# EAGLE design termocouple shield (EAGLE 5.11)
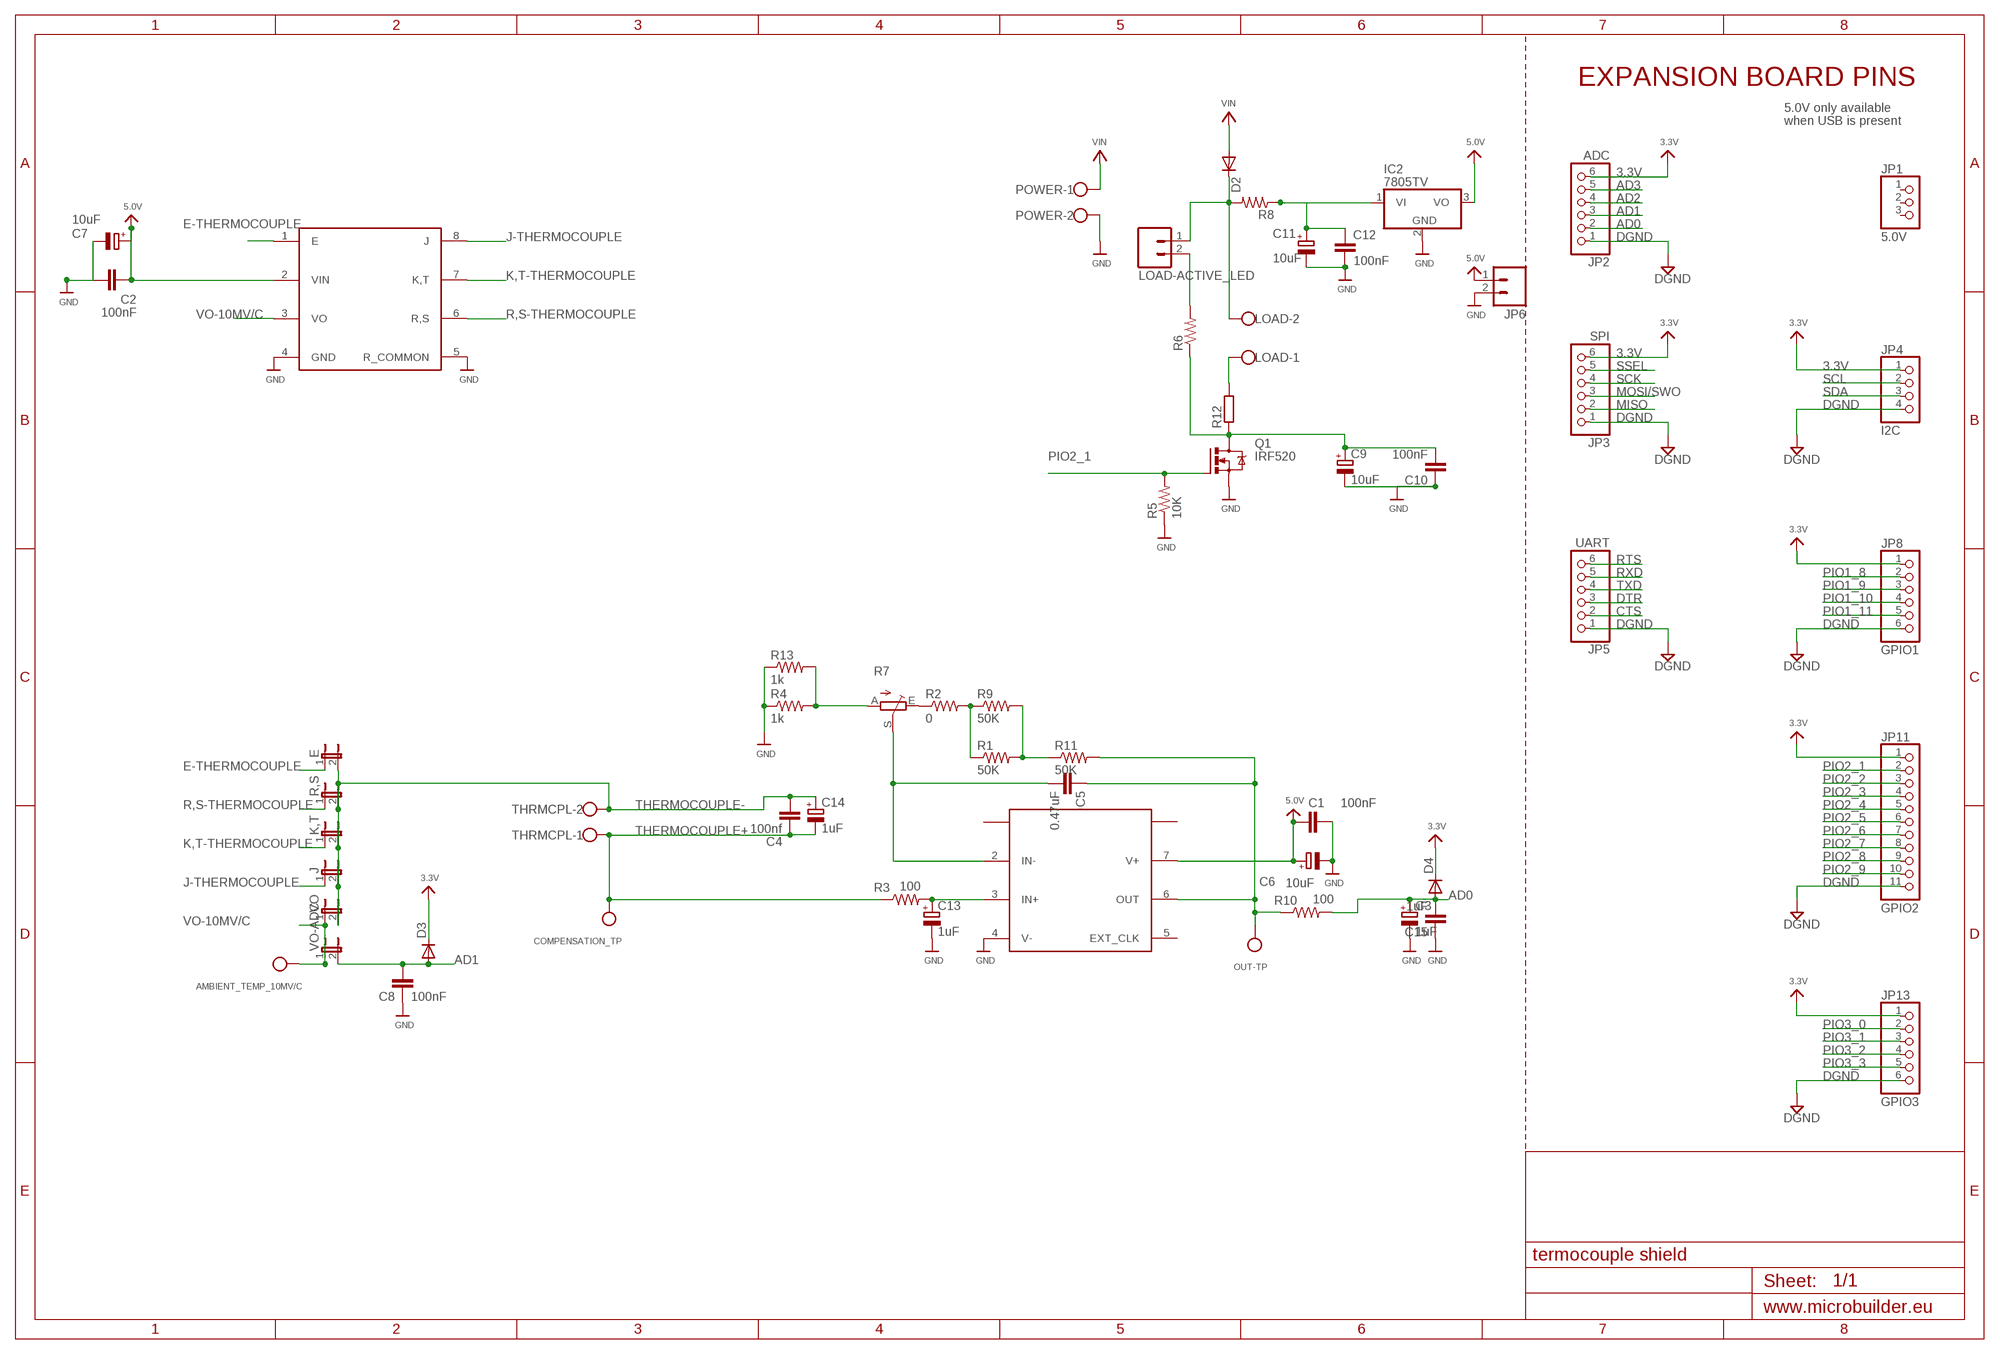
[diagram p0: schematic, sheet 1]

## Parts
AMBIENT_TEMP_10MV/C  TESTPOINT  [TESTPOINT_SMT]
C1  100nF  CAP0805  [0805]
C2  100nF  CAP0805  [0805]
C3  1uF  CPOL-EUB  [PANASONIC_B]
C4  100nf  CAP0805  [0805]
C5  0.47uF  CAP0805  [0805]
C6  10uF  CPOL-EUB  [PANASONIC_B]
C7  10uF  CPOL-EUB  [PANASONIC_B]
C8  100nF  CAP0805  [0805]
C9  10uF  CPOL-EUB  [PANASONIC_B]
C10  100nF  CAP0805  [0805]
C11  10uF  CPOL-EUB  [PANASONIC_B]
C12  100nF  CAP0805  [0805]
C13  1uF  CPOL-EUB  [PANASONIC_B]
C14  1uF  CPOL-EUB  [PANASONIC_B]
C15  1uF  CAP0805  [0805]
COMPENSATION_TP  TESTPOINT  [TESTPOINT_SMT]
D2  DIODEHV  [DIODE-HV]
D3  DIODE-SOD123  [SOD123]
D4  DIODE-SOD123  [SOD123]
E  JUMPER-2-OLDSMD-NO  [SJ_2S-NO]
IC2  7805TV  [TO220V]
J  JUMPER-2-OLDSMD-NO  [SJ_2S-NO]
JP1  5.0V  HEADER-1X3ROUND  [1X03_ROUND]
JP2  ADC  HEADER-1X6ROUND  [1X06_ROUND]
JP3  SPI  HEADER-1X6ROUND  [1X06_ROUND]
JP4  I2C  HEADER-1X4ROUND  [1X04_ROUND]
JP5  UART  HEADER-1X6ROUND  [1X06_ROUND]
JP6  M02LOCK_LONGPADS  [1X02_LOCK_LONGPADS]
JP8  GPIO1  HEADER-1X6ROUND  [1X06_ROUND]
JP11  GPIO2  HEADER-1X11  [1X11_ROUND]
JP13  GPIO3  HEADER-1X6ROUND  [1X06_ROUND]
K,T  JUMPER-2-OLDSMD-NO  [SJ_2S-NO]
LOAD  W237-102  [W237-102]
LOAD-ACTIVE_LED  M02POLAR  [MOLEX-1X2]
OUT-TP  TESTPOINT  [TESTPOINT_SMT]
POWER  W237-102  [W237-102]
Q1  IRF520  [TO220BV]
R1  50K  RESISTOR0805-RES  [0805]
R2  0  RESISTOR0805-RES  [0805]
R3  100  RESISTOR0805-RES  [0805]
R4  1k  RESISTOR0805-RES  [0805]
R5  10K  RESISTOR0805-RES  [0805]
R6  RESISTOR0805-RES  [0805]
R7  TRIM_EU-B64Y  [B64Y]
R8  RESISTOR0805-RES  [0805]
R9  50K  RESISTOR0805-RES  [0805]
R10  100  RESISTOR0805-RES  [0805]
R11  50K  RESISTOR0805-RES  [0805]
R12  R-EU_0617/17  [0617/17]
R13  1k  RESISTOR0805-RES  [0805]
R,S  JUMPER-2-OLDSMD-NO  [SJ_2S-NO]
THRMCPL  W237-102  [W237-102]
U$1  LT1050  [SOP8]
U$2  LT1025  [SOP8]
VO  JUMPER-2-OLDSMD-NO  [SJ_2S-NO]
VO-ADC  JUMPER-2-OLDSMD-NO  [SJ_2S-NO]

## Nets
3.3V: D3.C D4.C JP2.6 JP3.6 JP4.1 JP8.1 JP11.1 JP13.1
5.0V: C1.1 C2.2 C6.+ C7.+ IC2.3(VO) JP6.1 U$1.7(V+) U$2.2(VIN)
AD0: C3.+ C15.2 D4.A JP2.2 R10.2
AD1: C8.2 D3.A JP2.3 VO-ADC.2
AD2: JP2.4
AD3: JP2.5
CTS: JP5.2
DGND: JP2.1 JP3.1 JP4.4 JP5.1 JP8.6 JP11.11 JP13.6
DTR: JP5.3
E-THERMOCOUPLE: E.1 U$2.1(E)
FEEDBACK: C5.1 OUT-TP.P$1 R10.1 R11.2 U$1.6(OUT)
GND: C1.2 C2.1 C3.- C6.- C7.- C8.1 C9.- C10.1 C11.- C12.1 C13.- C15.1 IC2.2(GND) JP6.2 POWER.2 Q1.S R4.1 R5.1 R13.1 U$1.4(V-) U$2.4(GND) U$2.5(R_COMMON)
J-THERMOCOUPLE: J.1 U$2.8(J)
K,T-THERMOCOUPLE: K,T.1 U$2.7(K,T)
MISO: JP3.2
MOSI/SWO: JP3.3
N$1: C9.+ C10.2 Q1.D R6.1 R12.1
N$2: C13.+ R3.2 U$1.3(IN+)
N$3: LOAD-ACTIVE_LED.2 R6.2
N$4: R1.1 R2.2 R9.1
N$5: C5.2 R7.S U$1.2(IN-)
N$6: D2.C LOAD-ACTIVE_LED.1 LOAD.2 R8.2
N$7: R4.2 R7.A R13.2
N$8: R2.1 R7.E
N$9: C11.+ C12.2 IC2.1(VI) R8.1
N$10: LOAD.1 R12.2
N$12: R1.2 R9.2 R11.1
PIO1_8: JP8.2
PIO1_9: JP8.3
PIO1_10: JP8.4
PIO1_11: JP8.5
PIO2_1: JP11.2 Q1.G R5.2
PIO2_2: JP11.3
PIO2_3: JP11.4
PIO2_4: JP11.5
PIO2_5: JP11.6
PIO2_6: JP11.7
PIO2_7: JP11.8
PIO2_8: JP11.9
PIO2_9: JP11.10
PIO3_0: JP13.2
PIO3_1: JP13.3
PIO3_2: JP13.4
PIO3_3: JP13.5
R,S-THERMOCOUPLE: R,S.1 U$2.6(R,S)
RTS: JP5.6
RXD: JP5.5
SCK: JP3.4
SCL: JP4.2
SDA: JP4.3
SSEL: JP3.5
THERMOCOUPLE+: C4.1 C14.- COMPENSATION_TP.P$1 R3.1 THRMCPL.1
THERMOCOUPLE-: C4.2 C14.+ E.2 J.2 K,T.2 R,S.2 THRMCPL.2 VO.2
TXD: JP5.4
VIN: D2.A POWER.1
VO-10MV/C: AMBIENT_TEMP_10MV/C.P$1 U$2.3(VO) VO-ADC.1 VO.1
Unconnected: JP1.1 JP1.2 JP1.3 U$1.1 U$1.5(EXT_CLK) U$1.8

## Notes on the sheet
- EXPANSION BOARD PINS
- 5.0V only available
- when USB is present

## Library data of the parts
AMBIENT_TEMP_10MV/C COMPENSATION_TP OUT-TP = microbuilder:TESTPOINT: Test Point TESTPOINT_SMT - Compact Surface Mount Test Point [Digikey: 5016KTR-ND] TESTPOINT_PAD - Square Pad (2mm) TESTPOINT_SMT - Round Pad (2mm) TESTPOINT_0.1" - 0.1" Header
C1 C2 C4 C5 C8 C10 C12 C15 = SparkFun:CAP: Capacitor Standard 0603 ceramic capacitor, and 0.1" leaded capacitor.
C3 C6 C7 C9 C11 C13 C14 = resistor:CPOL-EU: POLARIZED CAPACITOR, European symbol
D2 = SparkFun:DIODE: Diode These are standard reverse protection diodes and small signal diodes. SMA package can handle up to about 1A. SOD-323 can handle about 200mA. What the SOD-323 package when ordering, there are some mfgs out there that are 5-pin packages.
D3 D4 = diode:DIODE-: DIODE
E J K,T R,S VO VO-ADC = SparkFun:JUMPER-2-OLD: Jumper Basic 0.1" spaced jumper. Use with breakaway headers.
IC2 = linear:78*: Positive VOLTAGE REGULATOR Source: http://cache.national.com/ds/LM/LM78L05.pdf http://www.fairchildsemi.com/ds/LM/LM7805.pdf
JP1 = microbuilder:HEADER-1X3: PIN HEADER
JP2 JP3 JP5 JP8 JP13 = microbuilder:HEADER-1X6: PIN HEADER
JP4 = microbuilder:HEADER-1X4: PIN HEADER
JP6 LOAD-ACTIVE_LED = SparkFun:M02: Header 2 Standard 2-pin 0.1" header. Use with straight break away headers (SKU : PRT-00116), right angle break away headers (PRT-00553), swiss pins (PRT-00743), machine pins (PRT-00117), and female headers (PRT-00115). Molex polarized connector foot print use with SKU : PRT-08233 with associated crimp pins and housings.
JP11 = microbuilder:HEADER-1X11
LOAD POWER THRMCPL = con-wago-500:W237-102: WAGO SCREW CLAMP; MPN: 237-102; OC_FARNELL: unknown; OC_NEWARK: 70K9898
Q1 = transistor-power:IRF520: HEXFET Power MOSFET
R1-R6 R8-R11 R13 = SparkFun:RESISTOR: Resistor Basic schematic elements and footprints for 0603, 1206, and PTH resistors.
R7 = pot:TRIM_EU-: POTENTIOMETER
R12 = resistor:R-EU_: RESISTOR, European symbol
U$1 = mic-misc:LT1050
U$2 = mic-misc:LT1025

## Board
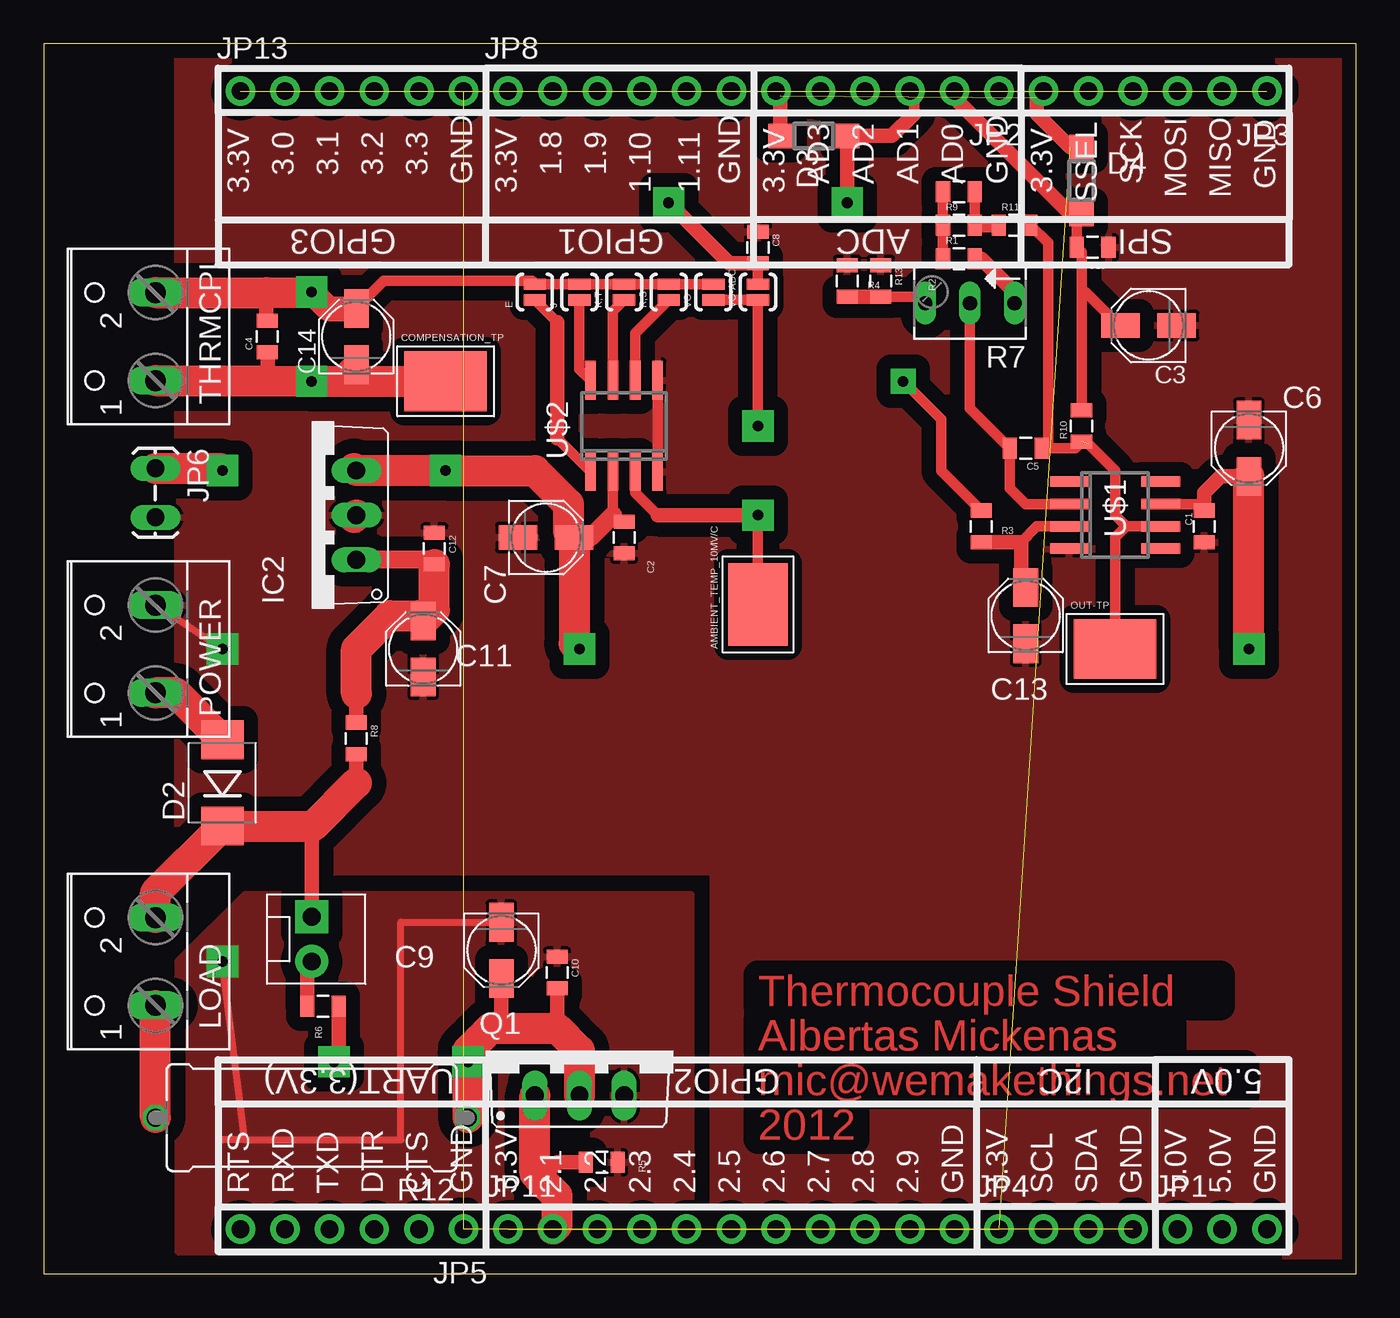
[diagram p1: board, top side]
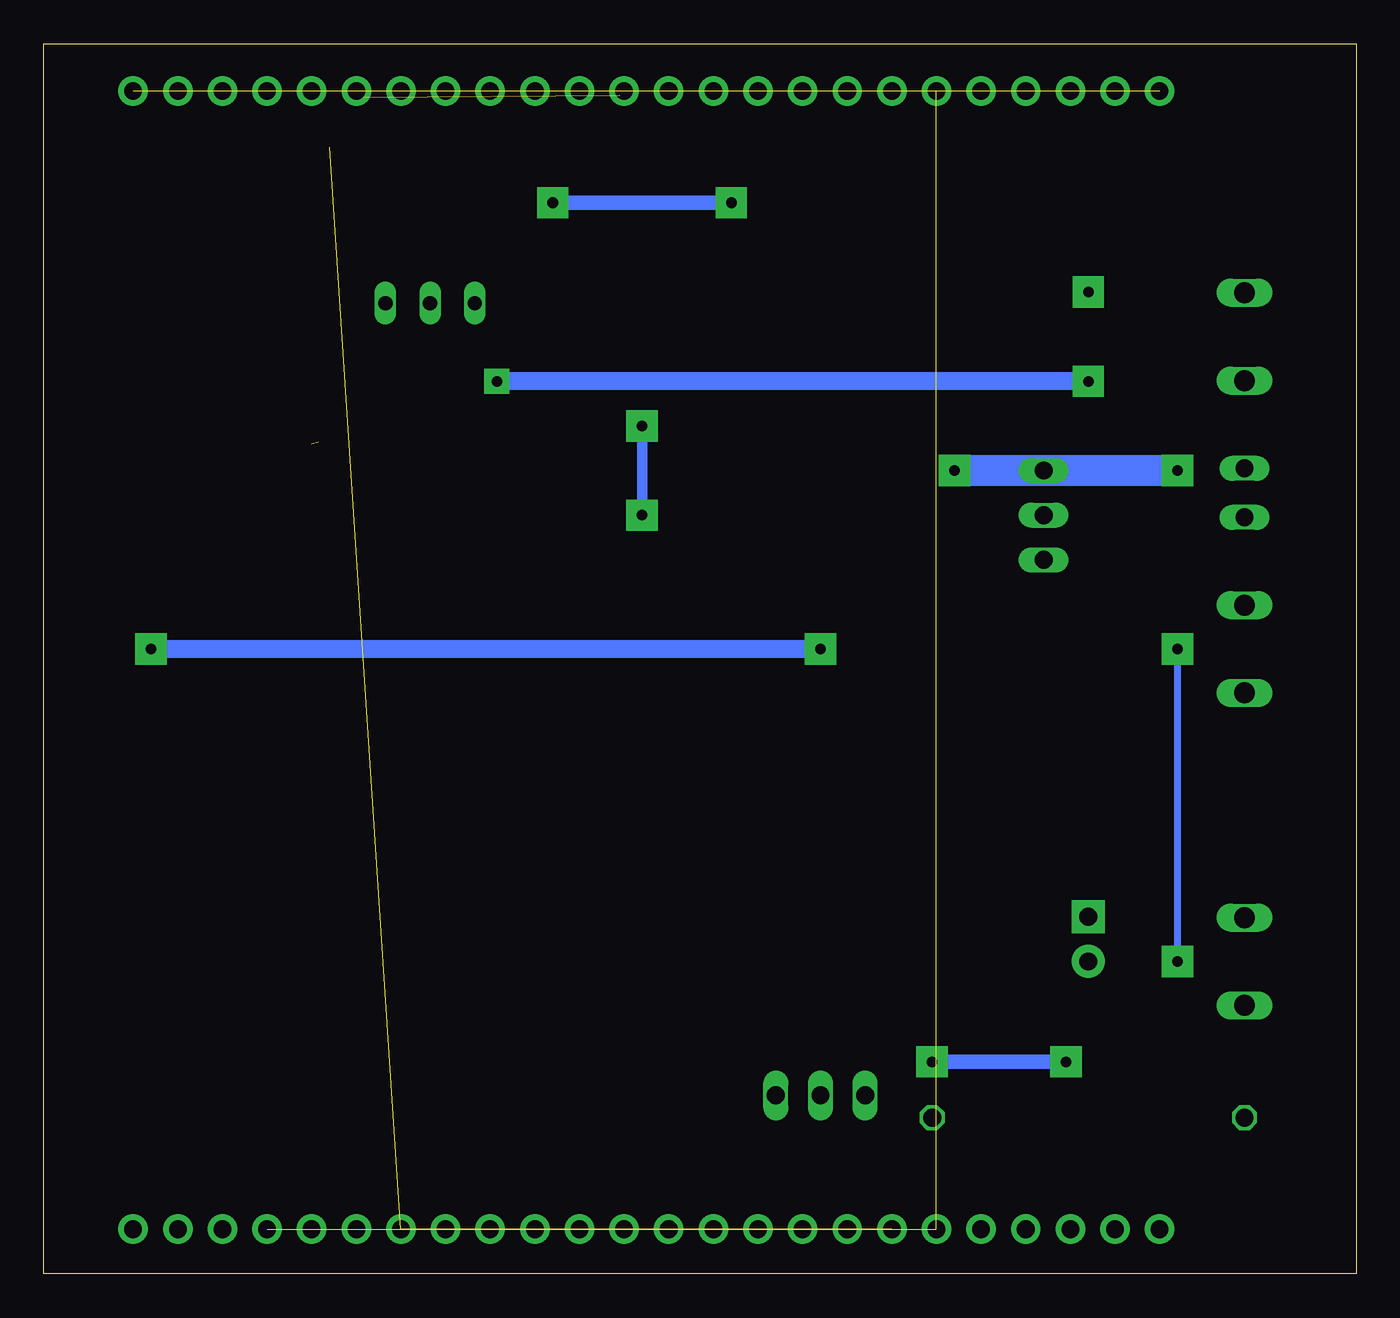
[diagram p2: board, bottom side, seen from below]

Size 74.68 x 70 mm. Coordinates in mm from the lower left corner, seen from the top.
Outline: 74.68,0 74.68,70 0,70 0,0 74.68,0
Copper layers (1*16): Top 0.035mm / dielectric 1.5mm / Bottom 0.035mm
Design rules "PCBCart-.1mmAnnulars": minimum track width 8mil, minimum drill 0.4mm, track to track 8mil, track to pad 8mil, pad to pad 8mil, via to via 8mil, smd to smd 8mil, copper to edge 20mil, drill to drill 8mil, minimum pad ring 8mil, minimum via ring 4mil, stop-mask expansion 3mil, vias tented up to drill 0mil, thermal gap 8mil
tRestrict: area 22.9,2.3 to 23,2.7; area 23.7,3.5 to 24.1,3.5; area 24.8,2.3 to 24.8,2.7; area 51.6,3.5 to 52,3.5; area 52.8,2.3 to 52.8,2.7; area 61,2.3 to 61.1,2.7; area 61.8,3.5 to 62.2,3.5; area 62.9,2.3 to 62.9,2.7; area 68.6,2.3 to 68.7,2.7; area 69.4,3.5 to 69.8,3.5; area 70.5,2.3 to 70.6,2.7; area 69.4,66.4 to 69.8,66.4; 11 more areas

### Footprints (pad centres in the part's own frame; a part is rotated, then mirrored left to right if it is on the bottom)
TESTPOINT_SMT = smd 4.7 x 3.4: P$1 0,0
0805 = smd 0.8 x 1.2: 1 -0.9,0; 2 0.9,0
PANASONIC_B = smd 2.2 x 1.4: + 1.6,0; - -1.6,0
DIODE-HV = smd 2.2 x 2.4: A 2.454,0; C -2.454,0
SOD123 = smd 1.4 x 1.4: A 1.9,0; C -1.9,0
SJ_2S-NO = smd 0.635 x 1.27: 1 -0.45,0; 2 0.45,0
TO220V = drill 1.016 long: 1 -2.54,-2.54; 2 0,-2.54; 3 2.54,-2.54
1X03_ROUND = drill 1 pad 1.676 round: 1 -2.54,0; 2 0,0; 3 2.54,0
1X06_ROUND = drill 1 pad 1.676 round: 1 -6.35,0; 2 -3.81,0; 3 -1.27,0; 4 1.27,0; 5 3.81,0; 6 6.35,0
1X04_ROUND = drill 1 pad 1.676 round: 1 -3.81,0; 2 -1.27,0; 3 1.27,0; 4 3.81,0
1X02_LOCK_LONGPADS = drill 1.016 long: 1 -0.127,0; 2 2.667,0
1X11_ROUND = drill 1 pad 1.676 round: 1 -12.7,0; 2 -10.16,0; 3 -7.62,0; 4 -5.08,0; 5 -2.54,0; 6 0,0; 7 2.54,0; 8 5.08,0; 9 7.62,0; 10 10.16,0; 11 12.7,0
W237-102 = drill 1.194 long: 1 -2.5,-1.27; 2 2.5,-1.27
MOLEX-1X2 = drill 1.016 pad 1.88 square: 1 0,0 | drill 1.016 pad 1.88 round: 2 2.54,0
TO220BV = drill 1.016 long: D 0,-2.54; G -2.54,-2.54; S 2.54,-2.54
B64Y = drill 0.813 long: A 2.54,0; E -2.54,0; S 0,0
0617/17 = drill 1.016 octagon: 1 -8.89,0; 2 8.89,0
SOP8 = smd 0.6 x 2.2: 1 -1.905,-2.6; 2 -0.635,-2.6; 3 0.635,-2.6; 4 1.905,-2.6; 5 1.905,2.6; 6 0.635,2.6; 7 -0.635,2.6; 8 -1.905,2.6

### Placement (x,y rotation side)
AMBIENT_TEMP_10MV/C  40.64,38.1 90 top
C1  66.04,42.55 270 top
C2  33.02,41.91 90 top
C3  62.87,53.98 180 top
C4  12.7,53.34 90 top
C5  55.88,46.99 180 top
C6  68.58,46.99 270 top
C7  28.57,41.91 0 top
C8  40.64,58.42 270 top
C9  26.04,18.41 270 top
C10  29.21,17.14 270 top
C11  21.59,35.56 90 top
C12  22.22,41.27 270 top
C13  55.88,37.47 90 top
C14  17.78,53.34 90 top
C15  59.69,58.42 180 top
COMPENSATION_TP  22.86,50.8 0 top
D2  10.16,27.94 90 top
D3  43.82,64.77 0 top
D4  59.05,62.23 270 top
E  27.94,55.88 90 top
IC2  15.24,43.18 90 top
J  30.48,55.88 90 top
JP1  67.06,2.54 0 top
JP2  48.01,67.31 180 top
JP3  63.25,67.31 180 top
JP4  58.17,2.54 0 top
JP5  17.53,2.54 180 top
JP6  6.35,45.72 270 top
JP8  32.77,67.31 0 top
JP11  39.12,2.54 0 top
JP13  17.53,67.31 0 top
K,T  33.02,55.88 90 top
LOAD  5.08,17.78 90 top
LOAD-ACTIVE_LED  15.24,20.32 270 top
OUT-TP  60.96,35.56 0 top
POWER  5.08,35.56 90 top
Q1  30.48,12.7 0 top
R1  52.07,59.69 0 top
R2  52.07,57.78 180 top
R3  53.34,42.55 270 top
R4  45.72,56.52 270 top
R5  31.75,6.35 180 top
R6  15.88,15.24 180 top
R7  52.71,55.24 180 top
R8  17.78,30.48 270 top
R9  52.07,61.59 0 top
R10  59.05,48.26 90 top
R11  55.25,59.69 0 top
R12  15.24,8.89 180 top
R13  47.62,56.52 270 top
R,S  35.56,55.88 90 top
THRMCPL  5.08,53.34 90 top
U$1  60.96,43.18 270 top
U$2  33.02,48.26 0 top
VO  38.1,55.88 90 top
VO-ADC  40.64,55.88 90 top

### Tracks (layer width: path | path; a pad name or v marks a point on that pad's centre or on a via)
3.3V  (5 unrouted)
  Top 0.813: 41.66,66.92 JP2.6 41.91,67.06 D3.C | D4.C 58.43,64.13 56.52,66.04 56.52,66.92 JP3.6
5.0V  (via drill 0.6 pad 1.78)
  Top 0.61: U$2.2 32.39,43.18 32.76,42.81 C2.2 | U$1.7 66.04,43.81 C1.1
  Top 0.813: C6.+ 66.98,45.39 66.04,44.45 66.04,43.81
  Top 1.016: C7.+ 31.11,41.91 32.39,43.18
  Top 1.778: v68.58,35.56 C6.+ | 17.65,45.85 IC2.3 v22.86,45.72 27.94,45.72 29.85,43.81 29.85,42.24 C7.+ 30.18,35.87 v30.48,35.56 | JP6.1 10.03,45.85 v10.16,45.72
  Bottom 1.016: v30.48,35.56 v68.58,35.56
  Bottom 1.778: v10.16,45.72 v22.86,45.72
AD0
  Top 0.406: 58.79,60.06 D4.A
  Top 0.61: 58.79,60.06 C15.2 59.05,58.16 59.05,55.88 | C3.+ 61.27,53.91 59.3,55.88 59.05,55.88 | D4.A 58.41,60.33 | 52.07,67.06 JP2.2 | R10.2 59.05,55.88
  Top 0.813: 58.41,60.33 52.07,66.67 52.07,67.06
AD1  (via drill 0.6 pad 1.78)
  Top 0.61: 49.53,66.04 49.53,67.06 JP2.3 | C8.2 VO-ADC.2
  Top 0.813: 49.53,66.04 48.26,64.77 D3.A v45.72,60.96 | C8.2 39,57.52 v35.56,60.96
  Bottom 0.813: v35.56,60.96 v45.72,60.96
DGND  (6 unrouted)
E-THERMOCOUPLE
  Top 0.61: 29.21,54.16 E.1 | U$2.1 29.21,47.56
  Top 0.813: 29.21,47.56 29.21,54.16
FEEDBACK  (1 unrouted)
  Top 0.406: C5.1 57.15,47.36
  Top 0.61: OUT-TP.P$1 60.96,41.91 61.6,42.55 | 61.6,42.55 U$1.6 | 61.6,42.55 60.96,43.18 60.96,45.72 59.43,47.26 | 57.15,47.36 57.15,58.69 R11.2 | R10.1 58.69,46.99 C5.1
GND  (via drill 0.6 pad 1.78)
  Top 0.406: C9.- 20.32,20.02 20.32,7.62 11.43,7.62 | 11.43,7.62 10.16,7.62 | 11.43,7.62 v10.16,17.78 | v10.16,35.56 6.35,38.1 POWER.2
  Top 0.61: U$2.4 U$2.5
  Top 1.778: 17.65,43.05 IC2.2
  Bottom 0.406: v10.16,17.78 v10.16,35.56
  pour Top (isolate 0.813): 7.62,22.86 7.62,70 74.68,70 74.68,0 38.1,0 38.1,22.86
  pour Top (isolate 0.813): 36.83,1.27 36.83,21.59 11.43,21.59 7.62,17.78 7.62,1.27
J-THERMOCOUPLE
  Top 0.61: J.1 30.48,51.49 U$2.8
K,T-THERMOCOUPLE
  Top 0.61: K,T.1 32.39,54.8 U$2.7
N$1  (via drill 0.6 pad 1.78)
  Top 0.813: 29.21,13.97 C10.2 | C9.+ 26.04,14.61 25.4,13.97 | R6.1 16.77,12.33 v16.51,12.06
  Top 1.778: R12.1 v24.13,12.06 24.13,12.7 24.76,13.34 25.4,13.97 29.21,13.97 30.48,12.7 Q1.D
  Bottom 0.813: v16.51,12.06 v24.13,12.06
N$2
  Top 0.61: 55.62,41.65 56.52,42.55 U$1.3 | 55.62,39.33 C13.+
  Top 0.813: R3.2 55.62,41.65 55.62,39.33
N$3
  Top 0.813: R6.2 14.97,17.52 LOAD-ACTIVE_LED.2
N$4
  Top 0.61: R2.2 R1.1 R9.1
N$5
  Top 0.406: 57.15,43.81 U$1.2
  Top 0.61: 57.15,43.81 55.88,43.81 54.98,44.72 C5.2 52.71,49.27 R7.S
N$6
  Top 0.813: 17.78,27.94 R8.2 | 15.24,25.49 LOAD-ACTIVE_LED.1
  Top 1.778: 17.78,27.94 15.33,25.49 15.24,25.49 D2.C 6.35,21.68 LOAD.2
N$7
  Top 0.61: R13.2 49.8,55.62 R7.A
  Top 0.813: R13.2 R4.2
N$8
  Top 0.813: R2.1 53.34,57.78 55.25,55.88 R7.E
N$9
  Top 0.813: R8.1 17.78,33.02
  Top 1.016: IC2.1 21.96,40.64 C12.2
  Top 1.778: 17.78,33.02 17.78,35.56 19.68,37.46 21.29,37.46 C11.+ 22.22,37.8 C12.2
N$10
  Top 1.778: R12.2 LOAD.1
N$12
  Top 0.61: R1.2 R9.2
  Top 0.813: R1.2 R11.1
PIO2_1
  Top 0.813: R5.2 29.21,6.35 28.26,5.4
  Top 1.778: Q1.G 27.94,5.71 28.26,5.4 29.21,4.45 29.21,2.79 JP11.2
R,S-THERMOCOUPLE
  Top 0.61: R,S.1 33.66,53.52 U$2.6
THERMOCOUPLE+  (via drill 0.6 pad 1.42, 0.6 pad 1.78)
  Top 0.61: R3.1 51.07,45.72 51.07,48.63 v48.9,50.8
  Top 0.813: C4.1 12.74,52.4 12.74,50.84
  Top 1.422: C14.- 16.84,50.8 v15.24,50.8
  Top 1.778: THRMCPL.1 12.74,50.84 v15.24,50.8 COMPENSATION_TP.P$1
  Bottom 1.016: v15.24,50.8 v48.9,50.8
THERMOCOUPLE-  (via drill 0.6 pad 1.78)
  Top 0.61: VO.2 R,S.2 K,T.2 J.2 E.2 27.75,56.52 19.36,56.52 C14.+
  Top 0.813: C4.2 12.66,54.28 12.66,55.84
  Top 1.422: v15.24,55.88 16.18,54.94 C14.+
  Top 1.778: THRMCPL.2 12.66,55.84 v15.24,55.88
VIN
  Top 1.778: POWER.1 7.49,33.06 D2.A
VO-10MV/C  (via drill 0.6 pad 1.78)
  Top 0.61: VO.1 VO-ADC.1 v40.64,48.26 | U$2.3 33.66,44.45 34.93,43.18 | v40.64,43.18 AMBIENT_TEMP_10MV/C.P$1
  Top 0.813: 34.93,43.18 v40.64,43.18
  Bottom 0.61: v40.64,43.18 v40.64,48.26

### Text on the board
Top: Thermocouple Shield | Albertas Mickenas | Albertas Mickenas | mic@wemakethings.net | 2012
tPlace: 3.0 | 3.1 | 3.2 | 3.3 | 1.8 | 1.9 | 3.3V | GND | 3.3V | 1.10 | 1.11 | GND | 3.3V | AD3 | AD2 | AD1 | AD0 | GND | 3.3V | SCK | GND | SSEL | MOSI | MISO | GPIO3 | GPIO1 | ADC | SPI | UART(3.3V) | GPIO2 | I2C | 5.0V | RTS | RXD | TXD | DTR | CTS | GND | 3.3V | 2.1 | 2.2 | 2.3 | 2.4 | 2.5 | 2.6 | 2.7 | 2.8 | 2.9 | GND | 3.3V | SCL | SDA | GND | 5.0V | 5.0V | GND